# Altium schematic sheet Sheet2.SchDoc
size A
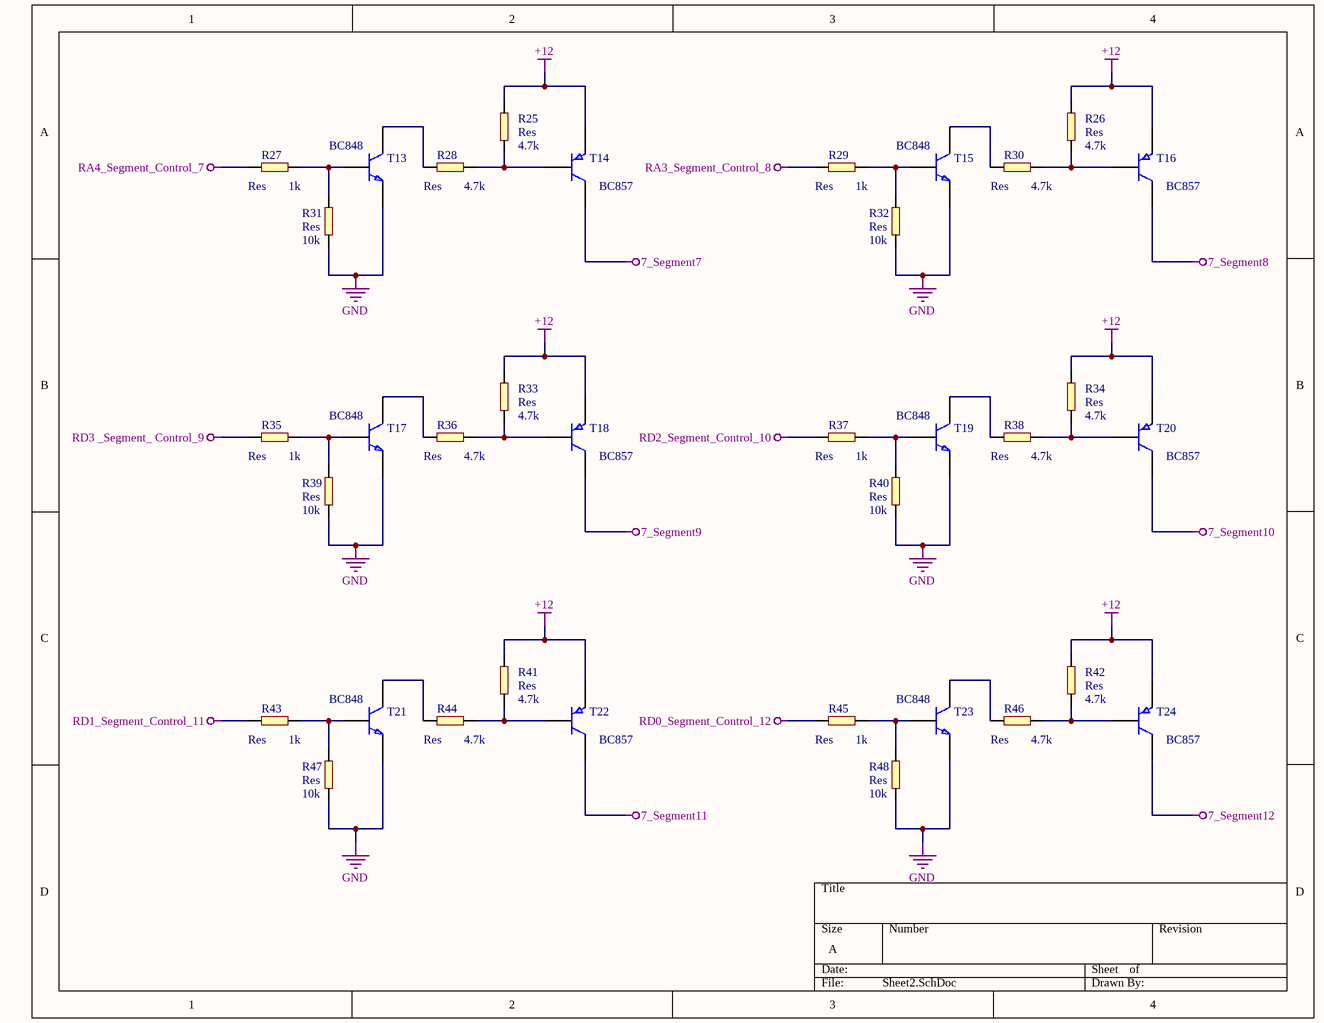
[diagram p0: Sheet2.SchDoc]

## Parts
R25  Res  value 4.7k  [RES0805]
R26  Res  value 4.7k  [RES0805]
R27  Res  value 1k  [RES0805]
R28  Res  value 4.7k  [RES0805]
R29  Res  value 1k  [RES0805]
R30  Res  value 4.7k  [RES0805]
R31  Res  value 10k  [RES0805]
R32  Res  value 10k  [RES0805]
R33  Res  value 4.7k  [RES0805]
R34  Res  value 4.7k  [RES0805]
R35  Res  value 1k  [RES0805]
R36  Res  value 4.7k  [RES0805]
R37  Res  value 1k  [RES0805]
R38  Res  value 4.7k  [RES0805]
R39  Res  value 10k  [RES0805]
R40  Res  value 10k  [RES0805]
R41  Res  value 4.7k  [RES0805]
R42  Res  value 4.7k  [RES0805]
R43  Res  value 1k  [RES0805]
R44  Res  value 4.7k  [RES0805]
R45  Res  value 1k  [RES0805]
R46  Res  value 4.7k  [RES0805]
R47  Res  value 10k  [RES0805]
R48  Res  value 10k  [RES0805]
T13  BC848  [SOT23]
T14  BC857  [SOT23]
T15  BC848  [SOT23]
T16  BC857  [SOT23]
T17  BC848  [SOT23]
T18  BC857  [SOT23]
T19  BC848  [SOT23]
T20  BC857  [SOT23]
T21  BC848  [SOT23]
T22  BC857  [SOT23]
T23  BC848  [SOT23]
T24  BC857  [SOT23]

## Nets
7_Segment7: T14.3(C)
7_Segment8: T16.3(C)
7_Segment9: T18.3(C)
7_Segment10: T20.3(C)
7_Segment11: T22.3(C)
7_Segment12: T24.3(C)
+12: R25.2(b) R26.2(b) R33.2(b) R34.2(b) R41.2(b) R42.2(b) T14.2(E) T16.2(E) T18.2(E) T20.2(E) T22.2(E) T24.2(E)
GND: R31.2(b) R32.2(b) R39.2(b) R40.2(b) R47.2(b) R48.2(b) T13.2(E) T15.2(E) T17.2(E) T19.2(E) T21.2(E) T23.2(E)
RA3_Segment_Control_8: R29.2(b)
RA4_Segment_Control_7: R27.2(b)
RD0_Segment_Control_12: R45.2(b)
RD1_Segment_Control_11: R43.2(b)
RD2_Segment_Control_10: R37.2(b)
RD3 _Segment_ Control_9: R35.2(b)
NetR25_1: R25.1(a) R28.1(a) T14.1(B)
NetR26_1: R26.1(a) R30.1(a) T16.1(B)
NetR27_1: R27.1(a) R31.1(a) T13.1(B)
NetR28_2: R28.2(b) T13.3(C)
NetR29_1: R29.1(a) R32.1(a) T15.1(B)
NetR30_2: R30.2(b) T15.3(C)
NetR33_1: R33.1(a) R36.1(a) T18.1(B)
NetR34_1: R34.1(a) R38.1(a) T20.1(B)
NetR35_1: R35.1(a) R39.1(a) T17.1(B)
NetR36_2: R36.2(b) T17.3(C)
NetR37_1: R37.1(a) R40.1(a) T19.1(B)
NetR38_2: R38.2(b) T19.3(C)
NetR41_1: R41.1(a) R44.1(a) T22.1(B)
NetR42_1: R42.1(a) R46.1(a) T24.1(B)
NetR43_1: R43.1(a) R47.1(a) T21.1(B)
NetR44_2: R44.2(b) T21.3(C)
NetR45_1: R45.1(a) R48.1(a) T23.1(B)
NetR46_2: R46.2(b) T23.3(C)

## Library data of the parts
R25-R48 = Resistor: Res0805
T13 T15 T17 T19 T21 T23 = BC848: TRANSISTOR